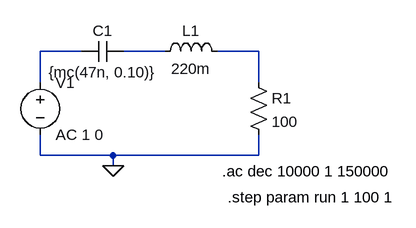
[diagram p0: schematic Draft1.asc]
Draft1.asc, the LTspice schematic file:
Version 4
SHEET 1 880 680
WIRE -64 80 -128 80
WIRE 64 80 0 80
WIRE 208 80 144 80
WIRE -128 128 -128 80
WIRE 208 128 208 80
WIRE -128 240 -128 208
WIRE -16 240 -128 240
WIRE 208 240 208 208
WIRE 208 240 -16 240
WIRE -16 256 -16 240
FLAG -16 256 0
SYMBOL voltage -128 112 R0
SYMATTR InstName V1
SYMATTR Value AC 1 0
SYMBOL cap 0 64 R90
WINDOW 0 0 32 VBottom 2
WINDOW 3 32 32 VTop 2
SYMATTR InstName C1
SYMATTR Value {mc(47n, 0.10)}
SYMBOL ind 48 96 R270
WINDOW 0 32 56 VTop 2
WINDOW 3 5 56 VBottom 2
SYMATTR InstName L1
SYMATTR Value 220m
SYMBOL res 192 112 R0
SYMATTR InstName R1
SYMATTR Value 100
TEXT 152 264 Left 2 !.ac dec 10000 1 150000
TEXT 160 304 Left 2 !.step param run 1 100 1

The netlist it stands for:
* Draft1.asc
V1 N001 0 AC 1 0
C1 N002 N001 {mc(47n, 0.10)}
L1 N002 N003 220m
R1 N003 0 100
.ac dec 10000 1 150000
.step param run 1 100 1
.backanno
.end